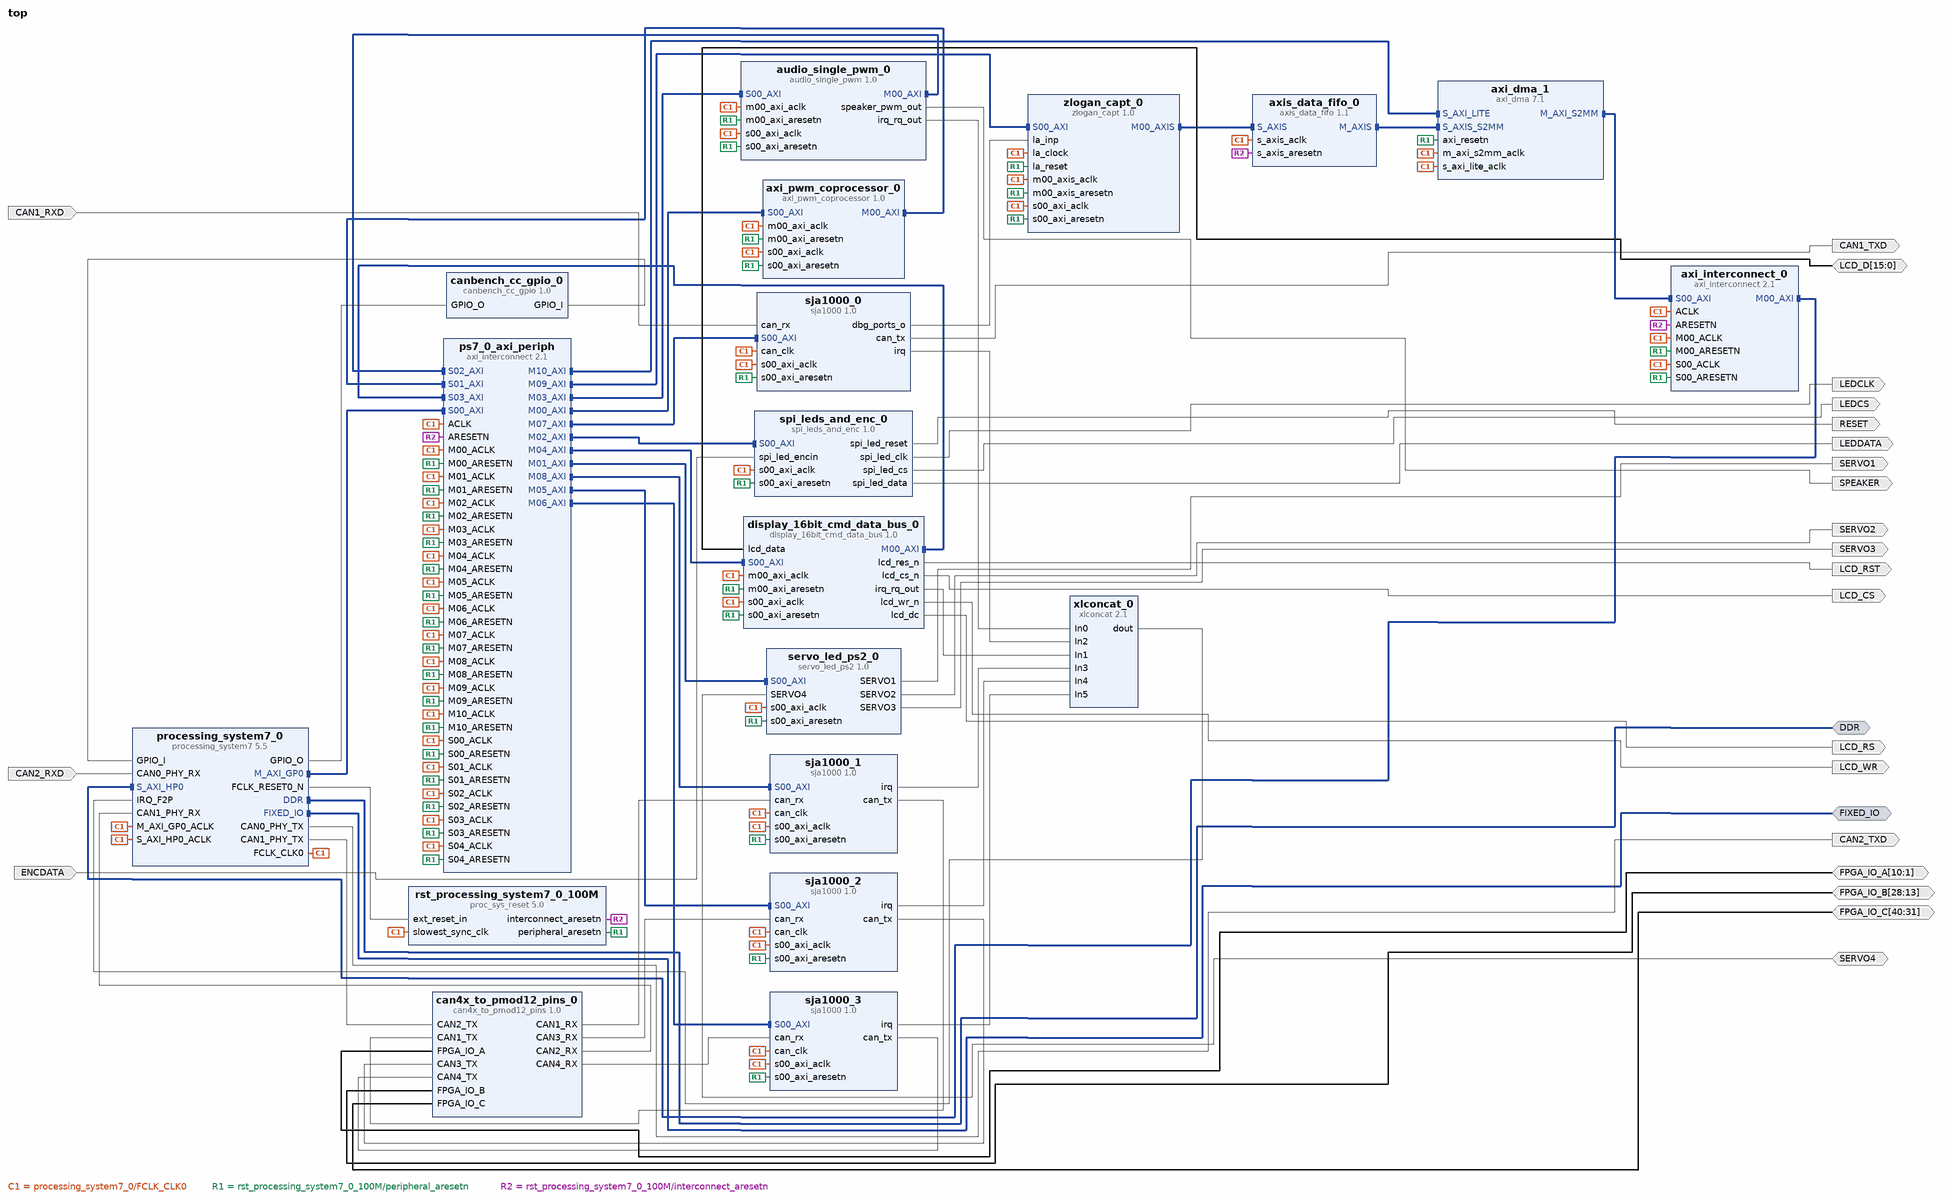
[diagram p0: block diagram of the top level]
# Vivado block design top, xc7z010clg400-1, Vivado 2017.4
create_bd_design top

create_bd_intf_port -mode Master -vlnv xilinx.com:interface:ddrx_rtl:1.0 DDR
create_bd_intf_port -mode Master -vlnv xilinx.com:display_processing_system7:fixedio_rtl:1.0 FIXED_IO
create_bd_port -dir I ENCDATA
create_bd_port -dir O RESET
create_bd_port -dir O LEDCLK
create_bd_port -dir O LEDCS
create_bd_port -dir O LEDDATA
create_bd_port -dir O SERVO1
create_bd_port -dir O SERVO2
create_bd_port -dir O SERVO3
create_bd_port -dir IO SERVO4
create_bd_port -dir IO -from 15 -to 0 -type data LCD_D
create_bd_port -dir O LCD_RST
create_bd_port -dir O LCD_WR
create_bd_port -dir O LCD_RS
create_bd_port -dir O SPEAKER
create_bd_port -dir O LCD_CS
create_bd_port -dir O CAN2_TXD
create_bd_port -dir I CAN2_RXD
create_bd_port -dir IO -from 10 -to 1 FPGA_IO_A
create_bd_port -dir IO -from 28 -to 13 FPGA_IO_B
create_bd_port -dir IO -from 40 -to 31 FPGA_IO_C
create_bd_port -dir O CAN1_TXD
create_bd_port -dir I CAN1_RXD

create_bd_cell -type ip -vlnv user.org:user:canbench_cc_gpio:1.0 canbench_cc_gpio_0
create_bd_cell -type ip -vlnv user.org:user:axi_pwm_coprocessor:1.0 axi_pwm_coprocessor_0
create_bd_cell -type ip -vlnv user.org:user:servo_led_ps2:1.0 servo_led_ps2_0
create_bd_cell -type ip -vlnv user.org:user:spi_leds_and_enc:1.0 spi_leds_and_enc_0
create_bd_cell -type ip -vlnv user.org:user:audio_single_pwm:1.0 audio_single_pwm_0
create_bd_cell -type ip -vlnv user.org:user:display_16bit_cmd_data_bus:1.0 display_16bit_cmd_data_bus_0
create_bd_cell -type ip -vlnv xilinx.com:ip:processing_system7:5.5 processing_system7_0
set_property -dict [list \
  CONFIG.PCW_UIPARAM_DDR_FREQ_MHZ 533.333333 \
  CONFIG.PCW_APU_PERIPHERAL_FREQMHZ 667 \
  CONFIG.PCW_SDIO_PERIPHERAL_FREQMHZ 50 \
  CONFIG.PCW_UART_PERIPHERAL_FREQMHZ 50 \
  CONFIG.PCW_CAN_PERIPHERAL_FREQMHZ 20 \
  CONFIG.PCW_FPGA0_PERIPHERAL_FREQMHZ 100 \
  CONFIG.PCW_FPGA1_PERIPHERAL_FREQMHZ 100 \
  CONFIG.PCW_FPGA2_PERIPHERAL_FREQMHZ 33.333333 \
  CONFIG.PCW_USE_S_AXI_HP0 1 \
  CONFIG.PCW_USE_FABRIC_INTERRUPT 1 \
  CONFIG.PCW_IRQ_F2P_INTR 1 \
  CONFIG.PCW_GP0_EN_MODIFIABLE_TXN 0 \
  CONFIG.PCW_GP1_EN_MODIFIABLE_TXN 0 \
  CONFIG.PCW_PERIPHERAL_BOARD_PRESET part0 \
  CONFIG.PCW_PRESET_BANK1_VOLTAGE {LVCMOS 1.8V} \
  CONFIG.PCW_UIPARAM_DDR_MEMORY_TYPE {DDR 3 (Low Voltage)} \
  CONFIG.PCW_UIPARAM_DDR_PARTNO {MT41K256M16 RE-125} \
  CONFIG.PCW_QSPI_PERIPHERAL_ENABLE 1 \
  CONFIG.PCW_QSPI_QSPI_IO {MIO 1 .. 6} \
  CONFIG.PCW_QSPI_GRP_SINGLE_SS_ENABLE 1 \
  CONFIG.PCW_QSPI_GRP_SINGLE_SS_IO {MIO 1 .. 6} \
  CONFIG.PCW_SINGLE_QSPI_DATA_MODE x4 \
  CONFIG.PCW_QSPI_GRP_FBCLK_ENABLE 1 \
  CONFIG.PCW_QSPI_GRP_FBCLK_IO {MIO 8} \
  CONFIG.PCW_ENET0_PERIPHERAL_ENABLE 1 \
  CONFIG.PCW_ENET0_ENET0_IO {MIO 16 .. 27} \
  CONFIG.PCW_ENET0_GRP_MDIO_ENABLE 1 \
  CONFIG.PCW_ENET0_GRP_MDIO_IO {MIO 52 .. 53} \
  CONFIG.PCW_ENET_RESET_ENABLE 1 \
  CONFIG.PCW_ENET_RESET_SELECT {Share reset pin} \
  CONFIG.PCW_ENET0_RESET_ENABLE 0 \
  CONFIG.PCW_SD0_PERIPHERAL_ENABLE 1 \
  CONFIG.PCW_SD0_SD0_IO {MIO 40 .. 45} \
  CONFIG.PCW_SD0_GRP_CD_ENABLE 1 \
  CONFIG.PCW_SD0_GRP_CD_IO {MIO 46} \
  CONFIG.PCW_SD0_GRP_WP_ENABLE 1 \
  CONFIG.PCW_SD0_GRP_WP_IO {MIO 50} \
  CONFIG.PCW_UART0_PERIPHERAL_ENABLE 1 \
  CONFIG.PCW_UART0_UART0_IO {MIO 10 .. 11} \
  CONFIG.PCW_UART1_PERIPHERAL_ENABLE 1 \
  CONFIG.PCW_UART1_UART1_IO {MIO 48 .. 49} \
  CONFIG.PCW_CAN0_PERIPHERAL_ENABLE 1 \
  CONFIG.PCW_CAN0_CAN0_IO EMIO \
  CONFIG.PCW_CAN1_PERIPHERAL_ENABLE 1 \
  CONFIG.PCW_CAN1_CAN1_IO EMIO \
  CONFIG.PCW_TTC0_PERIPHERAL_ENABLE 1 \
  CONFIG.PCW_TTC0_TTC0_IO EMIO \
  CONFIG.PCW_USB0_PERIPHERAL_ENABLE 1 \
  CONFIG.PCW_USB0_USB0_IO {MIO 28 .. 39} \
  CONFIG.PCW_USB_RESET_ENABLE 1 \
  CONFIG.PCW_USB_RESET_SELECT {Share reset pin} \
  CONFIG.PCW_USB0_RESET_ENABLE 0 \
  CONFIG.PCW_I2C_RESET_ENABLE 0 \
  CONFIG.PCW_GPIO_PERIPHERAL_ENABLE 1 \
  CONFIG.PCW_GPIO_MIO_GPIO_ENABLE 1 \
  CONFIG.PCW_GPIO_MIO_GPIO_IO MIO \
  CONFIG.PCW_GPIO_EMIO_GPIO_ENABLE 1 \
  CONFIG.PCW_GPIO_EMIO_GPIO_IO 64 \
] [get_bd_cells processing_system7_0]
# 520 more settings of processing_system7_0 are not shown: defaults, MIO pin electricals, DDR timing, and values the tool derives
create_bd_cell -type ip -vlnv xilinx.com:ip:proc_sys_reset:5.0 rst_processing_system7_0_100M
create_bd_cell -type ip -vlnv xilinx.com:ip:xlconcat:2.1 xlconcat_0
set_property -dict {CONFIG.NUM_PORTS 6 CONFIG.dout_width 6} [get_bd_cells xlconcat_0]
create_bd_cell -type ip -vlnv xilinx.com:ip:axi_interconnect:2.1 ps7_0_axi_periph
set_property -dict {CONFIG.NUM_SI 5 CONFIG.NUM_MI 11 CONFIG.ENABLE_ADVANCED_OPTIONS 0} [get_bd_cells ps7_0_axi_periph]
create_bd_cell -type ip -vlnv xilinx.com:ip:axis_data_fifo:1.1 axis_data_fifo_0
set_property -dict {CONFIG.TDATA_NUM_BYTES 8} [get_bd_cells axis_data_fifo_0]
create_bd_cell -type ip -vlnv pikron.com:user:can4x_to_pmod12_pins:1.0 can4x_to_pmod12_pins_0
create_bd_cell -type ip -vlnv xilinx.com:ip:axi_dma:7.1 axi_dma_1
set_property -dict [list \
  CONFIG.c_include_sg 0 \
  CONFIG.c_micro_dma 0 \
  CONFIG.c_include_mm2s 0 \
  CONFIG.c_addr_width 32 \
] [get_bd_cells axi_dma_1]
create_bd_cell -type ip -vlnv user.org:user:sja1000:1.0 sja1000_0
set_property -dict {CONFIG.C_S00_AXI_BASEADDR 0x43C00000 CONFIG.C_S00_AXI_HIGHADDR 0x43C0FFFF} [get_bd_cells sja1000_0]
create_bd_cell -type ip -vlnv user.org:user:sja1000:1.0 sja1000_1
create_bd_cell -type ip -vlnv user.org:user:sja1000:1.0 sja1000_2
create_bd_cell -type ip -vlnv user.org:user:sja1000:1.0 sja1000_3
create_bd_cell -type ip -vlnv xilinx.com:ip:axi_interconnect:2.1 axi_interconnect_0
set_property -dict {CONFIG.NUM_MI 1} [get_bd_cells axi_interconnect_0]
create_bd_cell -type ip -vlnv Eltvor:user:zlogan_capt:1.0 zlogan_capt_0
set_property -dict {CONFIG.la_n_inp 32 CONFIG.la_b_out 8 CONFIG.C_M00_AXIS_TDATA_WIDTH 64} [get_bd_cells zlogan_capt_0]

# ---- connections ----

connect_bd_intf_net [get_bd_intf_pins processing_system7_0/M_AXI_GP0] [get_bd_intf_pins ps7_0_axi_periph/S00_AXI]
connect_bd_intf_net [get_bd_intf_pins ps7_0_axi_periph/M00_AXI] [get_bd_intf_pins axi_pwm_coprocessor_0/S00_AXI]
connect_bd_intf_net [get_bd_intf_pins ps7_0_axi_periph/M01_AXI] [get_bd_intf_pins servo_led_ps2_0/S00_AXI]
connect_bd_intf_net [get_bd_intf_pins ps7_0_axi_periph/M02_AXI] [get_bd_intf_pins spi_leds_and_enc_0/S00_AXI]
connect_bd_intf_net [get_bd_intf_pins ps7_0_axi_periph/M03_AXI] [get_bd_intf_pins audio_single_pwm_0/S00_AXI]
connect_bd_intf_net [get_bd_intf_pins ps7_0_axi_periph/M04_AXI] [get_bd_intf_pins display_16bit_cmd_data_bus_0/S00_AXI]
connect_bd_intf_net [get_bd_intf_pins ps7_0_axi_periph/M06_AXI] [get_bd_intf_pins sja1000_3/S00_AXI]
connect_bd_intf_net [get_bd_intf_pins ps7_0_axi_periph/M05_AXI] [get_bd_intf_pins sja1000_2/S00_AXI]
connect_bd_intf_net [get_bd_intf_pins ps7_0_axi_periph/M08_AXI] [get_bd_intf_pins sja1000_1/S00_AXI]
connect_bd_intf_net [get_bd_intf_pins ps7_0_axi_periph/M07_AXI] [get_bd_intf_pins sja1000_0/S00_AXI]
connect_bd_intf_net [get_bd_intf_pins axi_pwm_coprocessor_0/M00_AXI] [get_bd_intf_pins ps7_0_axi_periph/S01_AXI]
connect_bd_intf_net [get_bd_intf_pins audio_single_pwm_0/M00_AXI] [get_bd_intf_pins ps7_0_axi_periph/S02_AXI]
connect_bd_intf_net [get_bd_intf_pins display_16bit_cmd_data_bus_0/M00_AXI] [get_bd_intf_pins ps7_0_axi_periph/S03_AXI]
connect_bd_intf_net [get_bd_intf_pins ps7_0_axi_periph/M09_AXI] [get_bd_intf_pins zlogan_capt_0/S00_AXI]
connect_bd_intf_net [get_bd_intf_pins zlogan_capt_0/M00_AXIS] [get_bd_intf_pins axis_data_fifo_0/S_AXIS]
connect_bd_intf_net [get_bd_intf_pins ps7_0_axi_periph/M10_AXI] [get_bd_intf_pins axi_dma_1/S_AXI_LITE]
connect_bd_intf_net [get_bd_intf_pins axis_data_fifo_0/M_AXIS] [get_bd_intf_pins axi_dma_1/S_AXIS_S2MM]
connect_bd_intf_net [get_bd_intf_pins axi_dma_1/M_AXI_S2MM] [get_bd_intf_pins axi_interconnect_0/S00_AXI]
connect_bd_intf_net [get_bd_intf_pins processing_system7_0/S_AXI_HP0] [get_bd_intf_pins axi_interconnect_0/M00_AXI]
connect_bd_intf_net [get_bd_intf_ports DDR] [get_bd_intf_pins processing_system7_0/DDR]
connect_bd_intf_net [get_bd_intf_ports FIXED_IO] [get_bd_intf_pins processing_system7_0/FIXED_IO]
connect_bd_net [get_bd_pins processing_system7_0/FCLK_CLK0] \
  [get_bd_pins axi_pwm_coprocessor_0/m00_axi_aclk] [get_bd_pins axi_pwm_coprocessor_0/s00_axi_aclk] \
  [get_bd_pins servo_led_ps2_0/s00_axi_aclk] [get_bd_pins spi_leds_and_enc_0/s00_axi_aclk] \
  [get_bd_pins audio_single_pwm_0/s00_axi_aclk] [get_bd_pins audio_single_pwm_0/m00_axi_aclk] \
  [get_bd_pins display_16bit_cmd_data_bus_0/s00_axi_aclk] [get_bd_pins display_16bit_cmd_data_bus_0/m00_axi_aclk] \
  [get_bd_pins processing_system7_0/M_AXI_GP0_ACLK] [get_bd_pins rst_processing_system7_0_100M/slowest_sync_clk] \
  [get_bd_pins axis_data_fifo_0/s_axis_aclk] [get_bd_pins ps7_0_axi_periph/S00_ACLK] [get_bd_pins ps7_0_axi_periph/M00_ACLK] \
  [get_bd_pins ps7_0_axi_periph/ACLK] [get_bd_pins ps7_0_axi_periph/M01_ACLK] [get_bd_pins ps7_0_axi_periph/M02_ACLK] \
  [get_bd_pins ps7_0_axi_periph/M03_ACLK] [get_bd_pins ps7_0_axi_periph/M04_ACLK] [get_bd_pins ps7_0_axi_periph/M05_ACLK] \
  [get_bd_pins ps7_0_axi_periph/M06_ACLK] [get_bd_pins ps7_0_axi_periph/M07_ACLK] [get_bd_pins ps7_0_axi_periph/M08_ACLK] \
  [get_bd_pins ps7_0_axi_periph/S01_ACLK] [get_bd_pins ps7_0_axi_periph/S02_ACLK] [get_bd_pins ps7_0_axi_periph/S03_ACLK] \
  [get_bd_pins ps7_0_axi_periph/M09_ACLK] [get_bd_pins ps7_0_axi_periph/S04_ACLK] [get_bd_pins ps7_0_axi_periph/M10_ACLK] \
  [get_bd_pins axi_dma_1/s_axi_lite_aclk] [get_bd_pins axi_dma_1/m_axi_s2mm_aclk] [get_bd_pins sja1000_0/can_clk] \
  [get_bd_pins sja1000_0/s00_axi_aclk] [get_bd_pins sja1000_1/can_clk] [get_bd_pins sja1000_1/s00_axi_aclk] \
  [get_bd_pins sja1000_2/can_clk] [get_bd_pins sja1000_2/s00_axi_aclk] [get_bd_pins sja1000_3/can_clk] \
  [get_bd_pins sja1000_3/s00_axi_aclk] [get_bd_pins processing_system7_0/S_AXI_HP0_ACLK] \
  [get_bd_pins axi_interconnect_0/M00_ACLK] [get_bd_pins axi_interconnect_0/ACLK] [get_bd_pins axi_interconnect_0/S00_ACLK] \
  [get_bd_pins zlogan_capt_0/la_clock] [get_bd_pins zlogan_capt_0/s00_axi_aclk] [get_bd_pins zlogan_capt_0/m00_axis_aclk]
connect_bd_net [get_bd_pins processing_system7_0/FCLK_RESET0_N] [get_bd_pins rst_processing_system7_0_100M/ext_reset_in]
connect_bd_net [get_bd_pins rst_processing_system7_0_100M/peripheral_aresetn] \
  [get_bd_pins axi_pwm_coprocessor_0/m00_axi_aresetn] [get_bd_pins axi_pwm_coprocessor_0/s00_axi_aresetn] \
  [get_bd_pins servo_led_ps2_0/s00_axi_aresetn] [get_bd_pins spi_leds_and_enc_0/s00_axi_aresetn] \
  [get_bd_pins audio_single_pwm_0/s00_axi_aresetn] [get_bd_pins audio_single_pwm_0/m00_axi_aresetn] \
  [get_bd_pins display_16bit_cmd_data_bus_0/s00_axi_aresetn] [get_bd_pins display_16bit_cmd_data_bus_0/m00_axi_aresetn] \
  [get_bd_pins ps7_0_axi_periph/S00_ARESETN] [get_bd_pins ps7_0_axi_periph/M00_ARESETN] \
  [get_bd_pins ps7_0_axi_periph/M01_ARESETN] [get_bd_pins ps7_0_axi_periph/M02_ARESETN] \
  [get_bd_pins ps7_0_axi_periph/M03_ARESETN] [get_bd_pins ps7_0_axi_periph/M04_ARESETN] \
  [get_bd_pins ps7_0_axi_periph/M05_ARESETN] [get_bd_pins ps7_0_axi_periph/M06_ARESETN] \
  [get_bd_pins ps7_0_axi_periph/M07_ARESETN] [get_bd_pins ps7_0_axi_periph/M08_ARESETN] \
  [get_bd_pins ps7_0_axi_periph/S01_ARESETN] [get_bd_pins ps7_0_axi_periph/S02_ARESETN] \
  [get_bd_pins ps7_0_axi_periph/S03_ARESETN] [get_bd_pins ps7_0_axi_periph/M09_ARESETN] \
  [get_bd_pins ps7_0_axi_periph/S04_ARESETN] [get_bd_pins ps7_0_axi_periph/M10_ARESETN] [get_bd_pins axi_dma_1/axi_resetn] \
  [get_bd_pins sja1000_0/s00_axi_aresetn] [get_bd_pins sja1000_1/s00_axi_aresetn] [get_bd_pins sja1000_2/s00_axi_aresetn] \
  [get_bd_pins sja1000_3/s00_axi_aresetn] [get_bd_pins axi_interconnect_0/M00_ARESETN] \
  [get_bd_pins axi_interconnect_0/S00_ARESETN] [get_bd_pins zlogan_capt_0/la_reset] \
  [get_bd_pins zlogan_capt_0/s00_axi_aresetn] [get_bd_pins zlogan_capt_0/m00_axis_aresetn]
connect_bd_net [get_bd_pins rst_processing_system7_0_100M/interconnect_aresetn] \
  [get_bd_pins axis_data_fifo_0/s_axis_aresetn] [get_bd_pins ps7_0_axi_periph/ARESETN] \
  [get_bd_pins axi_interconnect_0/ARESETN]
connect_bd_net [get_bd_pins canbench_cc_gpio_0/GPIO_I] [get_bd_pins processing_system7_0/GPIO_I]
connect_bd_net [get_bd_pins processing_system7_0/GPIO_O] [get_bd_pins canbench_cc_gpio_0/GPIO_O]
connect_bd_net [get_bd_pins xlconcat_0/dout] [get_bd_pins processing_system7_0/IRQ_F2P]
connect_bd_net [get_bd_ports ENCDATA] [get_bd_pins spi_leds_and_enc_0/spi_led_encin]
connect_bd_net [get_bd_pins spi_leds_and_enc_0/spi_led_reset] [get_bd_ports RESET]
connect_bd_net [get_bd_pins spi_leds_and_enc_0/spi_led_clk] [get_bd_ports LEDCLK]
connect_bd_net [get_bd_pins spi_leds_and_enc_0/spi_led_cs] [get_bd_ports LEDCS]
connect_bd_net [get_bd_pins spi_leds_and_enc_0/spi_led_data] [get_bd_ports LEDDATA]
connect_bd_net [get_bd_pins servo_led_ps2_0/SERVO1] [get_bd_ports SERVO1]
connect_bd_net [get_bd_pins servo_led_ps2_0/SERVO2] [get_bd_ports SERVO2]
connect_bd_net [get_bd_pins servo_led_ps2_0/SERVO3] [get_bd_ports SERVO3]
connect_bd_net [get_bd_ports SERVO4] [get_bd_pins servo_led_ps2_0/SERVO4]
connect_bd_net [get_bd_pins audio_single_pwm_0/irq_rq_out] [get_bd_pins xlconcat_0/In0]
connect_bd_net [get_bd_ports LCD_D] [get_bd_pins display_16bit_cmd_data_bus_0/lcd_data]
connect_bd_net [get_bd_pins display_16bit_cmd_data_bus_0/irq_rq_out] [get_bd_pins xlconcat_0/In1]
connect_bd_net [get_bd_pins display_16bit_cmd_data_bus_0/lcd_res_n] [get_bd_ports LCD_RST]
connect_bd_net [get_bd_pins display_16bit_cmd_data_bus_0/lcd_wr_n] [get_bd_ports LCD_WR]
connect_bd_net [get_bd_pins display_16bit_cmd_data_bus_0/lcd_dc] [get_bd_ports LCD_RS]
connect_bd_net [get_bd_pins audio_single_pwm_0/speaker_pwm_out] [get_bd_ports SPEAKER]
connect_bd_net [get_bd_pins display_16bit_cmd_data_bus_0/lcd_cs_n] [get_bd_ports LCD_CS]
connect_bd_net [get_bd_pins processing_system7_0/CAN0_PHY_TX] [get_bd_ports CAN2_TXD]
connect_bd_net [get_bd_ports CAN2_RXD] [get_bd_pins processing_system7_0/CAN0_PHY_RX]
connect_bd_net [get_bd_pins processing_system7_0/CAN1_PHY_TX] [get_bd_pins can4x_to_pmod12_pins_0/CAN2_TX]
connect_bd_net [get_bd_pins can4x_to_pmod12_pins_0/CAN2_RX] [get_bd_pins processing_system7_0/CAN1_PHY_RX]
connect_bd_net [get_bd_ports FPGA_IO_A] [get_bd_pins can4x_to_pmod12_pins_0/FPGA_IO_A]
connect_bd_net [get_bd_ports FPGA_IO_B] [get_bd_pins can4x_to_pmod12_pins_0/FPGA_IO_B]
connect_bd_net [get_bd_ports FPGA_IO_C] [get_bd_pins can4x_to_pmod12_pins_0/FPGA_IO_C]
connect_bd_net [get_bd_pins sja1000_3/irq] [get_bd_pins xlconcat_0/In5]
connect_bd_net [get_bd_pins sja1000_3/can_tx] [get_bd_pins can4x_to_pmod12_pins_0/CAN4_TX]
connect_bd_net [get_bd_pins can4x_to_pmod12_pins_0/CAN4_RX] [get_bd_pins sja1000_3/can_rx]
connect_bd_net [get_bd_pins sja1000_2/irq] [get_bd_pins xlconcat_0/In4]
connect_bd_net [get_bd_pins sja1000_2/can_tx] [get_bd_pins can4x_to_pmod12_pins_0/CAN3_TX]
connect_bd_net [get_bd_pins can4x_to_pmod12_pins_0/CAN3_RX] [get_bd_pins sja1000_2/can_rx]
connect_bd_net [get_bd_pins sja1000_1/irq] [get_bd_pins xlconcat_0/In3]
connect_bd_net [get_bd_pins sja1000_1/can_tx] [get_bd_pins can4x_to_pmod12_pins_0/CAN1_TX]
connect_bd_net [get_bd_pins can4x_to_pmod12_pins_0/CAN1_RX] [get_bd_pins sja1000_1/can_rx]
connect_bd_net [get_bd_pins sja1000_0/irq] [get_bd_pins xlconcat_0/In2]
connect_bd_net [get_bd_pins sja1000_0/can_tx] [get_bd_ports CAN1_TXD]
connect_bd_net [get_bd_ports CAN1_RXD] [get_bd_pins sja1000_0/can_rx]
connect_bd_net [get_bd_pins sja1000_0/dbg_ports_o] [get_bd_pins zlogan_capt_0/la_inp]

# ---- address map ----
assign_bd_address -offset 0x40400000 -range 64K -target_address_space [get_bd_addr_spaces audio_single_pwm_0/M00_AXI] [get_bd_addr_segs axi_dma_1/S_AXI_LITE/Reg]
assign_bd_address -offset 0x43C00000 -range 64K -target_address_space [get_bd_addr_spaces audio_single_pwm_0/M00_AXI] [get_bd_addr_segs display_16bit_cmd_data_bus_0/S00_AXI/S00_AXI_reg]
assign_bd_address -offset 0x43C10000 -range 4K -target_address_space [get_bd_addr_spaces audio_single_pwm_0/M00_AXI] [get_bd_addr_segs axi_pwm_coprocessor_0/S00_AXI/S00_AXI_reg]
assign_bd_address -offset 0x43C20000 -range 64K -target_address_space [get_bd_addr_spaces audio_single_pwm_0/M00_AXI] [get_bd_addr_segs zlogan_capt_0/S00_AXI/S00_AXI_reg]
assign_bd_address -offset 0x43C40000 -range 4K -target_address_space [get_bd_addr_spaces audio_single_pwm_0/M00_AXI] [get_bd_addr_segs spi_leds_and_enc_0/S00_AXI/S00_AXI_reg]
assign_bd_address -offset 0x43C50000 -range 4K -target_address_space [get_bd_addr_spaces audio_single_pwm_0/M00_AXI] [get_bd_addr_segs servo_led_ps2_0/S00_AXI/S00_AXI_reg]
assign_bd_address -offset 0x43C60000 -range 64K -target_address_space [get_bd_addr_spaces audio_single_pwm_0/M00_AXI] [get_bd_addr_segs audio_single_pwm_0/S00_AXI/S00_AXI_reg]
assign_bd_address -offset 0x43C80000 -range 64K -target_address_space [get_bd_addr_spaces audio_single_pwm_0/M00_AXI] [get_bd_addr_segs sja1000_0/S00_AXI/S00_AXI_reg]
assign_bd_address -offset 0x43C90000 -range 64K -target_address_space [get_bd_addr_spaces audio_single_pwm_0/M00_AXI] [get_bd_addr_segs sja1000_1/S00_AXI/S00_AXI_reg]
assign_bd_address -offset 0x43CA0000 -range 64K -target_address_space [get_bd_addr_spaces audio_single_pwm_0/M00_AXI] [get_bd_addr_segs sja1000_2/S00_AXI/S00_AXI_reg]
assign_bd_address -offset 0x43CB0000 -range 64K -target_address_space [get_bd_addr_spaces audio_single_pwm_0/M00_AXI] [get_bd_addr_segs sja1000_3/S00_AXI/S00_AXI_reg]
assign_bd_address -offset 0x00000000 -range 512M -target_address_space [get_bd_addr_spaces axi_dma_1/Data_S2MM] [get_bd_addr_segs processing_system7_0/S_AXI_HP0/HP0_DDR_LOWOCM]
assign_bd_address -offset 0x40400000 -range 64K -target_address_space [get_bd_addr_spaces axi_pwm_coprocessor_0/M00_AXI] [get_bd_addr_segs axi_dma_1/S_AXI_LITE/Reg]
assign_bd_address -offset 0x43C00000 -range 64K -target_address_space [get_bd_addr_spaces axi_pwm_coprocessor_0/M00_AXI] [get_bd_addr_segs display_16bit_cmd_data_bus_0/S00_AXI/S00_AXI_reg]
assign_bd_address -offset 0x43C10000 -range 4K -target_address_space [get_bd_addr_spaces axi_pwm_coprocessor_0/M00_AXI] [get_bd_addr_segs axi_pwm_coprocessor_0/S00_AXI/S00_AXI_reg]
assign_bd_address -offset 0x43C20000 -range 64K -target_address_space [get_bd_addr_spaces axi_pwm_coprocessor_0/M00_AXI] [get_bd_addr_segs zlogan_capt_0/S00_AXI/S00_AXI_reg]
assign_bd_address -offset 0x43C40000 -range 4K -target_address_space [get_bd_addr_spaces axi_pwm_coprocessor_0/M00_AXI] [get_bd_addr_segs spi_leds_and_enc_0/S00_AXI/S00_AXI_reg]
assign_bd_address -offset 0x43C50000 -range 4K -target_address_space [get_bd_addr_spaces axi_pwm_coprocessor_0/M00_AXI] [get_bd_addr_segs servo_led_ps2_0/S00_AXI/S00_AXI_reg]
assign_bd_address -offset 0x43C60000 -range 64K -target_address_space [get_bd_addr_spaces axi_pwm_coprocessor_0/M00_AXI] [get_bd_addr_segs audio_single_pwm_0/S00_AXI/S00_AXI_reg]
assign_bd_address -offset 0x43C80000 -range 64K -target_address_space [get_bd_addr_spaces axi_pwm_coprocessor_0/M00_AXI] [get_bd_addr_segs sja1000_0/S00_AXI/S00_AXI_reg]
assign_bd_address -offset 0x43C90000 -range 64K -target_address_space [get_bd_addr_spaces axi_pwm_coprocessor_0/M00_AXI] [get_bd_addr_segs sja1000_1/S00_AXI/S00_AXI_reg]
assign_bd_address -offset 0x43CA0000 -range 64K -target_address_space [get_bd_addr_spaces axi_pwm_coprocessor_0/M00_AXI] [get_bd_addr_segs sja1000_2/S00_AXI/S00_AXI_reg]
assign_bd_address -offset 0x43CB0000 -range 64K -target_address_space [get_bd_addr_spaces axi_pwm_coprocessor_0/M00_AXI] [get_bd_addr_segs sja1000_3/S00_AXI/S00_AXI_reg]
assign_bd_address -offset 0x40400000 -range 64K -target_address_space [get_bd_addr_spaces display_16bit_cmd_data_bus_0/M00_AXI] [get_bd_addr_segs axi_dma_1/S_AXI_LITE/Reg]
assign_bd_address -offset 0x43C00000 -range 64K -target_address_space [get_bd_addr_spaces display_16bit_cmd_data_bus_0/M00_AXI] [get_bd_addr_segs display_16bit_cmd_data_bus_0/S00_AXI/S00_AXI_reg]
assign_bd_address -offset 0x43C10000 -range 4K -target_address_space [get_bd_addr_spaces display_16bit_cmd_data_bus_0/M00_AXI] [get_bd_addr_segs axi_pwm_coprocessor_0/S00_AXI/S00_AXI_reg]
assign_bd_address -offset 0x43C20000 -range 64K -target_address_space [get_bd_addr_spaces display_16bit_cmd_data_bus_0/M00_AXI] [get_bd_addr_segs zlogan_capt_0/S00_AXI/S00_AXI_reg]
assign_bd_address -offset 0x43C40000 -range 4K -target_address_space [get_bd_addr_spaces display_16bit_cmd_data_bus_0/M00_AXI] [get_bd_addr_segs spi_leds_and_enc_0/S00_AXI/S00_AXI_reg]
assign_bd_address -offset 0x43C50000 -range 4K -target_address_space [get_bd_addr_spaces display_16bit_cmd_data_bus_0/M00_AXI] [get_bd_addr_segs servo_led_ps2_0/S00_AXI/S00_AXI_reg]
assign_bd_address -offset 0x43C60000 -range 64K -target_address_space [get_bd_addr_spaces display_16bit_cmd_data_bus_0/M00_AXI] [get_bd_addr_segs audio_single_pwm_0/S00_AXI/S00_AXI_reg]
assign_bd_address -offset 0x43C80000 -range 64K -target_address_space [get_bd_addr_spaces display_16bit_cmd_data_bus_0/M00_AXI] [get_bd_addr_segs sja1000_0/S00_AXI/S00_AXI_reg]
assign_bd_address -offset 0x43C90000 -range 64K -target_address_space [get_bd_addr_spaces display_16bit_cmd_data_bus_0/M00_AXI] [get_bd_addr_segs sja1000_1/S00_AXI/S00_AXI_reg]
assign_bd_address -offset 0x43CA0000 -range 64K -target_address_space [get_bd_addr_spaces display_16bit_cmd_data_bus_0/M00_AXI] [get_bd_addr_segs sja1000_2/S00_AXI/S00_AXI_reg]
assign_bd_address -offset 0x43CB0000 -range 64K -target_address_space [get_bd_addr_spaces display_16bit_cmd_data_bus_0/M00_AXI] [get_bd_addr_segs sja1000_3/S00_AXI/S00_AXI_reg]
assign_bd_address -offset 0x40400000 -range 64K -target_address_space [get_bd_addr_spaces processing_system7_0/Data] [get_bd_addr_segs axi_dma_1/S_AXI_LITE/Reg]
assign_bd_address -offset 0x43C00000 -range 64K -target_address_space [get_bd_addr_spaces processing_system7_0/Data] [get_bd_addr_segs display_16bit_cmd_data_bus_0/S00_AXI/S00_AXI_reg]
assign_bd_address -offset 0x43C10000 -range 4K -target_address_space [get_bd_addr_spaces processing_system7_0/Data] [get_bd_addr_segs axi_pwm_coprocessor_0/S00_AXI/S00_AXI_reg]
assign_bd_address -offset 0x43C20000 -range 64K -target_address_space [get_bd_addr_spaces processing_system7_0/Data] [get_bd_addr_segs zlogan_capt_0/S00_AXI/S00_AXI_reg]
assign_bd_address -offset 0x43C40000 -range 4K -target_address_space [get_bd_addr_spaces processing_system7_0/Data] [get_bd_addr_segs spi_leds_and_enc_0/S00_AXI/S00_AXI_reg]
assign_bd_address -offset 0x43C50000 -range 4K -target_address_space [get_bd_addr_spaces processing_system7_0/Data] [get_bd_addr_segs servo_led_ps2_0/S00_AXI/S00_AXI_reg]
assign_bd_address -offset 0x43C60000 -range 64K -target_address_space [get_bd_addr_spaces processing_system7_0/Data] [get_bd_addr_segs audio_single_pwm_0/S00_AXI/S00_AXI_reg]
assign_bd_address -offset 0x43C80000 -range 64K -target_address_space [get_bd_addr_spaces processing_system7_0/Data] [get_bd_addr_segs sja1000_0/S00_AXI/S00_AXI_reg]
assign_bd_address -offset 0x43C90000 -range 64K -target_address_space [get_bd_addr_spaces processing_system7_0/Data] [get_bd_addr_segs sja1000_1/S00_AXI/S00_AXI_reg]
assign_bd_address -offset 0x43CA0000 -range 64K -target_address_space [get_bd_addr_spaces processing_system7_0/Data] [get_bd_addr_segs sja1000_2/S00_AXI/S00_AXI_reg]
assign_bd_address -offset 0x43CB0000 -range 64K -target_address_space [get_bd_addr_spaces processing_system7_0/Data] [get_bd_addr_segs sja1000_3/S00_AXI/S00_AXI_reg]

validate_bd_design
save_bd_design
